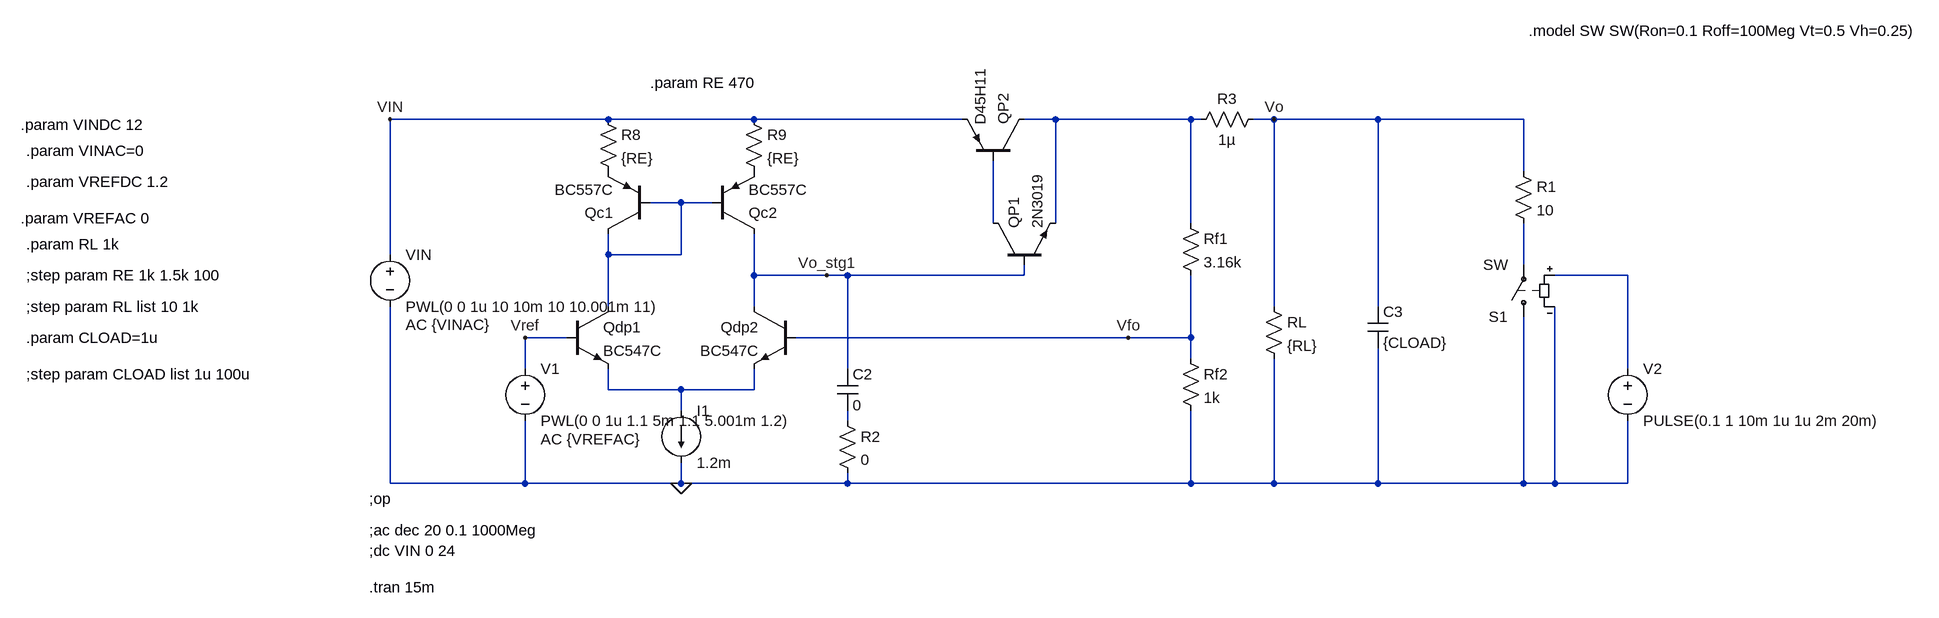
[diagram p0: schematic Regulador_Lineal_version4_tran.asc]
Regulador_Lineal_version4_tran.asc, the LTspice schematic file:
Version 4
SHEET 1 2404 1324
WIRE 96 -32 -240 -32
WIRE 320 -32 96 -32
WIRE 640 -32 320 -32
WIRE 784 -32 736 -32
WIRE 992 -32 784 -32
WIRE 1008 -32 992 -32
WIRE 1120 -32 1088 -32
WIRE 1280 -32 1120 -32
WIRE 1504 -32 1280 -32
WIRE 1504 48 1504 -32
WIRE 208 96 160 96
WIRE 256 96 208 96
WIRE 688 128 688 32
WIRE 784 128 784 -32
WIRE 992 128 992 -32
WIRE -240 176 -240 -32
WIRE 96 176 96 144
WIRE 208 176 208 96
WIRE 208 176 96 176
WIRE 1504 192 1504 128
WIRE 320 208 320 144
WIRE 432 208 320 208
WIRE 464 208 432 208
WIRE 736 208 736 192
WIRE 736 208 464 208
WIRE 1664 208 1552 208
WIRE 96 256 96 176
WIRE 320 256 320 208
WIRE 1120 256 1120 -32
WIRE 1280 256 1280 -32
WIRE 32 304 -32 304
WIRE 896 304 384 304
WIRE 992 304 992 208
WIRE 992 304 896 304
WIRE 992 336 992 304
WIRE -32 352 -32 304
WIRE 464 352 464 208
WIRE 1664 352 1664 208
WIRE 96 384 96 352
WIRE 208 384 96 384
WIRE 320 384 320 352
WIRE 320 384 208 384
WIRE 208 416 208 384
WIRE 464 432 464 416
WIRE -240 528 -240 256
WIRE -32 528 -32 432
WIRE -32 528 -240 528
WIRE 208 528 208 496
WIRE 208 528 -32 528
WIRE 464 528 464 512
WIRE 464 528 208 528
WIRE 992 528 992 416
WIRE 992 528 464 528
WIRE 1120 528 1120 336
WIRE 1120 528 992 528
WIRE 1280 528 1280 320
WIRE 1280 528 1120 528
WIRE 1504 528 1504 272
WIRE 1504 528 1280 528
WIRE 1552 528 1552 256
WIRE 1552 528 1504 528
WIRE 1664 528 1664 432
WIRE 1664 528 1552 528
FLAG 208 528 0
FLAG 1120 -32 Vo
FLAG -32 304 Vref
FLAG -240 -32 VIN
FLAG 896 304 Vfo
FLAG 432 208 Vo_stg1
SYMBOL pnp 160 144 R180
SYMATTR InstName Qc1
SYMATTR Value BC557C
SYMBOL pnp 256 144 M180
SYMATTR InstName Qc2
SYMATTR Value BC557C
SYMBOL npn 32 256 R0
SYMATTR InstName Qdp1
SYMATTR Value BC547C
SYMBOL npn 384 256 M0
SYMATTR InstName Qdp2
SYMATTR Value BC547C
SYMBOL pnp 736 32 M270
SYMATTR InstName QP2
SYMATTR Value D45H11
SYMBOL npn 688 192 R270
SYMATTR InstName QP1
SYMATTR Value 2N3019
SYMBOL res 976 112 R0
SYMATTR InstName Rf1
SYMATTR Value 3.16k
SYMBOL res 976 320 R0
SYMATTR InstName Rf2
SYMATTR Value 1k
SYMBOL res 1104 240 R0
SYMATTR InstName RL
SYMATTR Value {RL}
SYMBOL voltage -32 336 R0
WINDOW 123 24 124 Left 2
WINDOW 39 0 0 Left 0
SYMATTR Value2 AC {VREFAC}
SYMATTR InstName V1
SYMATTR Value PWL(0 0 1u 1.1 5m 1.1 5.001m 1.2)
SYMBOL voltage -240 160 R0
WINDOW 123 24 124 Left 2
WINDOW 39 0 0 Left 0
SYMATTR Value2 AC {VINAC}
SYMATTR InstName VIN
SYMATTR Value PWL(0 0 1u 10 10m 10 10.001m 11)
SYMBOL res 80 -48 R0
SYMATTR InstName R8
SYMATTR Value {RE}
SYMBOL res 304 -48 R0
SYMATTR InstName R9
SYMATTR Value {RE}
SYMBOL cap 1264 256 R0
SYMATTR InstName C3
SYMATTR Value {CLOAD}
SYMBOL cap 448 352 R0
SYMATTR InstName C2
SYMATTR Value 0
SYMBOL res 448 416 R0
SYMATTR InstName R2
SYMATTR Value 0
SYMBOL current 208 416 R0
WINDOW 123 0 0 Left 0
WINDOW 39 0 0 Left 0
SYMATTR InstName I1
SYMATTR Value 1.2m
SYMBOL voltage 1664 336 R0
WINDOW 123 0 0 Left 0
WINDOW 39 0 0 Left 0
SYMATTR InstName V2
SYMATTR Value PULSE(0.1 1 10m 1u 1u 2m 20m)
SYMBOL sw 1504 288 R180
SYMATTR InstName S1
SYMBOL res 1488 32 R0
SYMATTR InstName R1
SYMATTR Value 10
SYMBOL res 1104 -48 R90
WINDOW 0 0 56 VBottom 2
WINDOW 3 32 56 VTop 2
SYMATTR InstName R3
SYMATTR Value 1µ
TEXT -272 552 Left 2 !;op
TEXT -272 600 Left 2 !;ac dec 20 0.1 1000Meg
TEXT -808 -24 Left 2 !.param VINDC 12
TEXT -800 16 Left 2 !.param VINAC=0
TEXT -800 64 Left 2 !.param VREFDC 1.2
TEXT -808 120 Left 2 !.param VREFAC 0
TEXT -800 160 Left 2 !.param RL 1k
TEXT -272 632 Left 2 !;dc VIN 0 24
TEXT -800 208 Left 2 !;step param RE 1k 1.5k 100
TEXT 160 -88 Left 2 !.param RE 470
TEXT -800 256 Left 2 !;step param RL list 10 1k
TEXT -800 304 Left 2 !.param CLOAD=1u
TEXT -800 360 Left 2 !;step param CLOAD list 1u 100u
TEXT -272 688 Left 2 !.tran 15m
TEXT 1512 -168 Left 2 !.model SW SW(Ron=0.1 Roff=100Meg Vt=0.5 Vh=0.25)

The netlist it stands for:
* Regulador_Lineal_version4_tran.asc
Qc1 N002 N002 P001 0 BC557C
Qc2 Vo_stg1 N002 P002 0 BC557C
Qdp1 N002 Vref N006 0 BC547C
Qdp2 Vo_stg1 Vfo N006 0 BC547C
QP2 N001 N003 VIN 0 D45H11
QP1 N003 Vo_stg1 N001 0 2N3019
Rf1 N001 Vfo 3.16k
Rf2 Vfo 0 1k
RL Vo 0 {RL}
V1 Vref 0 PWL(0 0 1u 1.1 5m 1.1 5.001m 1.2) AC {VREFAC}
VIN VIN 0 PWL(0 0 1u 10 10m 10 10.001m 11) AC {VINAC}
R8 VIN P001 {RE}
R9 VIN P002 {RE}
C3 Vo 0 {CLOAD}
C2 Vo_stg1 N007 0
R2 N007 0 0
I1 N006 0 1.2m
V2 N005 0 PULSE(0.1 1 10m 1u 1u 2m 20m)
S1 0 N004 N005 0 SW
R1 Vo N004 10
R3 Vo N001 1µ
.model NPN NPN
.model PNP PNP
.lib standard.bjt
;op
;ac dec 20 0.1 1000Meg
.param VINDC 12
.param VINAC=0
.param VREFDC 1.2
.param VREFAC 0
.param RL 1k
;dc VIN 0 24
;step param RE 1k 1.5k 100
.param RE 470
;step param RL list 10 1k
.param CLOAD=1u
;step param CLOAD list 1u 100u
.tran 15m
.model SW SW(Ron=0.1 Roff=100Meg Vt=0.5 Vh=0.25)
.backanno
.end